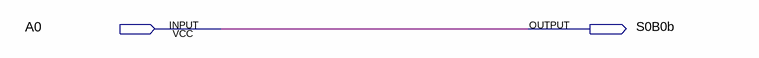
[diagram p0: schematic sheet]
// Quartus schematic S0(B0b).bdf as structural Verilog: 0 symbols, 2 pins
module \S0(B0b)  (
  input  A0,
  output S0B0b
);


  assign S0B0b = A0;
endmodule
